# Altium schematic sheet camera.SchDoc
size A4
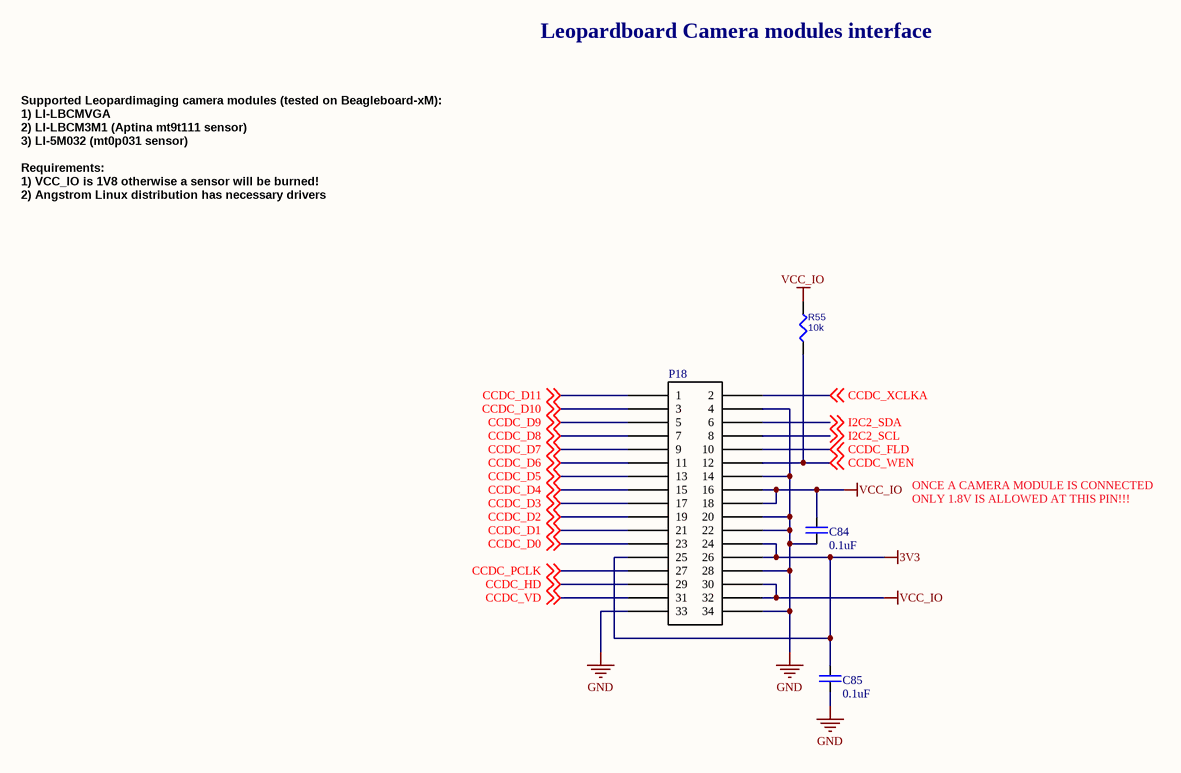
[diagram p0: camera.SchDoc]

## Parts
C84  value 0.1uF  [CHIP0603]  (hidden comment: C0603)
C85  value 0.1uF  [CHIP0603]  (hidden comment: C0603)
P18  20021321-00034T4LF  [20021321-00034T4LF]  (value not drawn)
R55  value 10k  [CHIP0603]  (hidden comment: R0603)

## Nets
3V3: C85.1 P18.24 P18.25 P18.26
GND: C84.2 C85.2 P18.4 P18.14 P18.20 P18.22 P18.28 P18.33 P18.34
VCC_IO: C84.1 P18.16 P18.18 P18.30 P18.32 R55.2
CCDC_D0: P18.23 ; off-sheet CCDC_D0
CCDC_D1: P18.21 ; off-sheet CCDC_D1
CCDC_D2: P18.19 ; off-sheet CCDC_D2
CCDC_D3: P18.17 ; off-sheet CCDC_D3
CCDC_D4: P18.15 ; off-sheet CCDC_D4
CCDC_D5: P18.13 ; off-sheet CCDC_D5
CCDC_D6: P18.11 ; off-sheet CCDC_D6
CCDC_D7: P18.9 ; off-sheet CCDC_D7
CCDC_D8: P18.7 ; off-sheet CCDC_D8
CCDC_D9: P18.5 ; off-sheet CCDC_D9
CCDC_D10: P18.3 ; off-sheet CCDC_D10
CCDC_D11: P18.1 ; off-sheet CCDC_D11
CCDC_FLD: P18.10 ; off-sheet CCDC_FLD
CCDC_HD: P18.29 ; off-sheet CCDC_HD
CCDC_PCLK: P18.27 ; off-sheet CCDC_PCLK
CCDC_VD: P18.31 ; off-sheet CCDC_VD
CCDC_WEN: P18.12 R55.1 ; off-sheet CCDC_WEN
CCDC_XCLKA: P18.2 ; off-sheet CCDC_XCLKA
I2C2_SCL: P18.8 ; off-sheet I2C2_SCL
I2C2_SDA: P18.6 ; off-sheet I2C2_SDA

## Notes on the sheet
- Leopardboard Camera modules interface
- Supported Leopardimaging camera modules (tested on Beagleboard-xM):
  1) LI-LBCMVGA
  2) LI-LBCM3M1 (Aptina mt9t111 sensor)
  3) LI-5M032 (mt0p031 sensor)
  Requirements:
  1) VCC_IO is 1V8 otherwise a sensor will be burned!
  2) Angstrom Linux distribution has necessary drivers
- ONCE A CAMERA MODULE IS CONNECTED
  ONLY 1.8V IS ALLOWED AT THIS PIN!!!

## Library data of the parts
C84 C85 = C0603: Ceramic capacitor C0603
P18 = 20021321-00034T4LF: CONN RECEPT 34POS DUAL SMD; Manufacturer: Minitek; Vendor: Digikey; Vendor P/N: 609-3777-ND; Man P/N: 20021321-00034T4LF
R55 = R0603: Resistor 0603